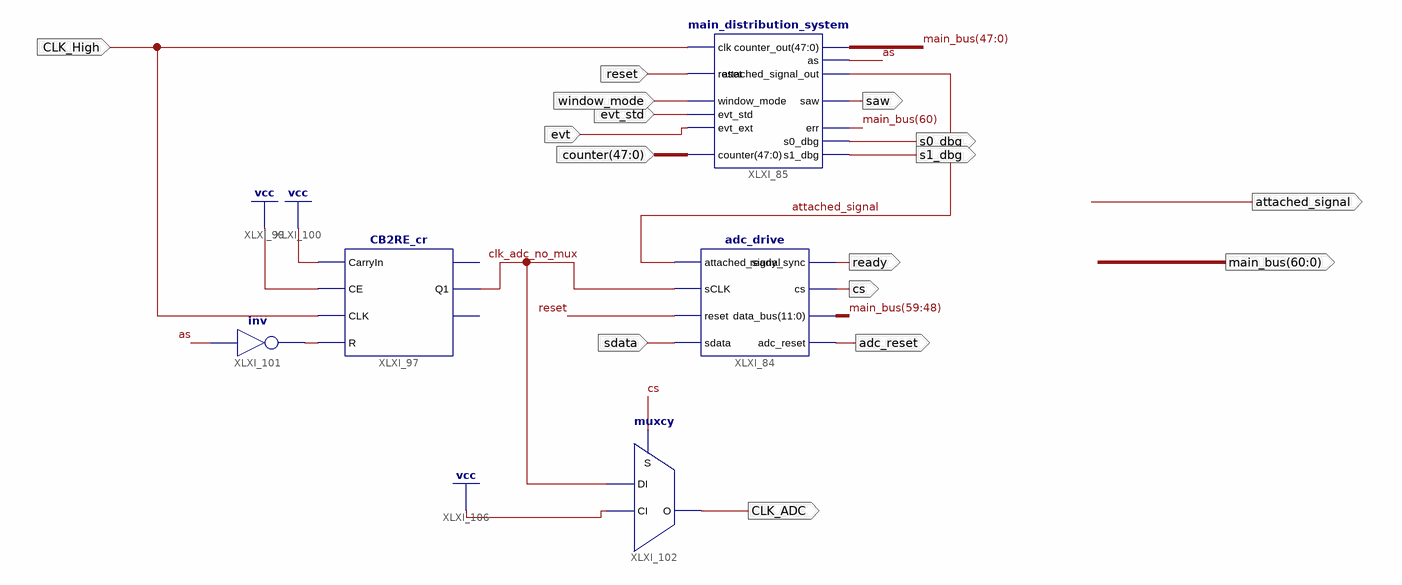
[diagram p0: schematic sheet 1]
// Xilinx ISE schematic event_handler.sch (spartan6) as structural Verilog: 5 symbols, 16 ports
module event_handler (
  input  CLK_High,
  input  evt,
  input  reset,
  input  [47:0] counter,
  input  evt_std,
  input  sdata,
  input  window_mode,
  output saw,
  output [60:0] main_bus,
  output ready,
  output cs,
  output adc_reset,
  output s0_dbg,
  output s1_dbg,
  output attached_signal,
  output CLK_ADC
);

  wire as, clk_adc_no_mux, XLXN_227;

  adc_drive XLXI_84 (
    .attached_signal(attached_signal), .sCLK(clk_adc_no_mux), .reset(reset), .sdata(sdata),
    .ready_sync(ready), .cs(cs), .data_bus(main_bus[59:48]), .adc_reset(adc_reset));
  main_distribution_system XLXI_85 (
    .clk(CLK_High), .reset(reset), .evt_ext(evt), .counter(counter), .err(main_bus[60]), .saw(saw),
    .attached_signal_out(attached_signal), .counter_out(main_bus[47:0]), .evt_std(evt_std), .s0_dbg(s0_dbg),
    .s1_dbg(s1_dbg), .as(as), .window_mode(window_mode));
  CB2RE_cr XLXI_97 (
    .CarryIn(1'b1), .CLK(CLK_High), .R(XLXN_227), .CE(1'b1), .Q1(clk_adc_no_mux));  // open: CarryOut, Q0
  not XLXI_101 (XLXN_227, as);
  muxcy XLXI_102 (.CI(1'b1), .DI(clk_adc_no_mux), .S(cs), .O(CLK_ADC));
endmodule
